# EAGLE design termocouple (EAGLE 6.5.0)
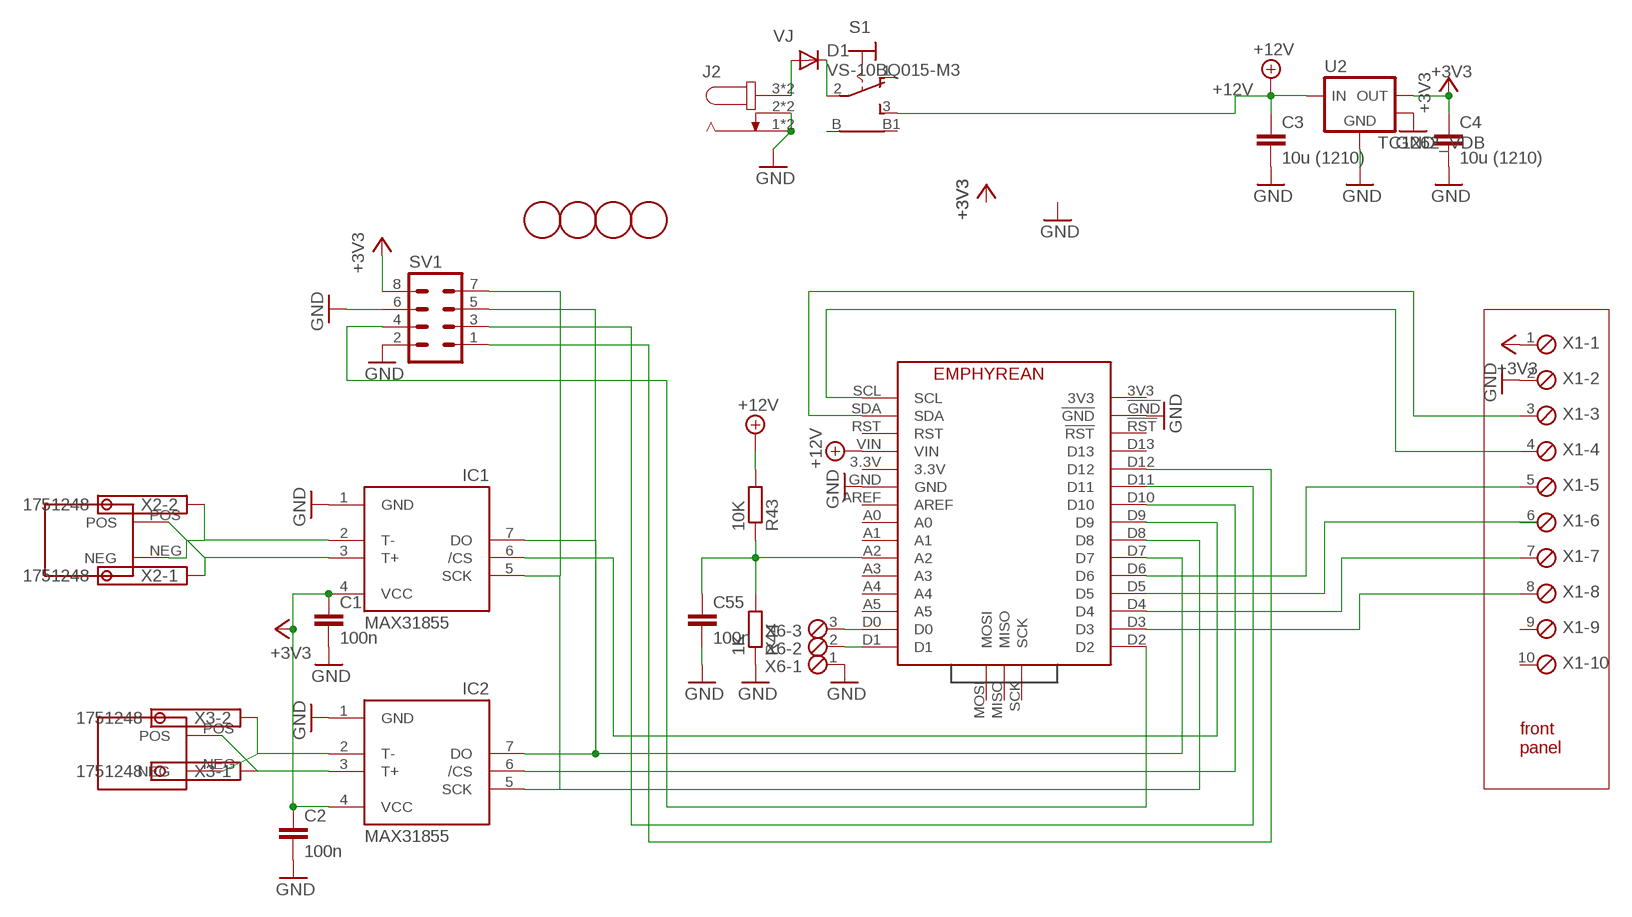
[diagram p0: schematic, sheet 1]

## Parts
C1  100n  C-EUC1206  [C1206]
C2  100n  C-EUC1206  [C1206]
C3  10u (1210)  C-EUC1210  [C1210]
C4  10u (1210)  C-EUC1210  [C1210]
C55  100n  C-EUC1206  [C1206]
D1  VS-10BQ015-M3  DIODE-SMB  [SMB]
IC1  MAX31855  MAX6675  [SO08]
IC2  MAX31855  MAX6675  [SO08]
J2  JACK-PLUG  [SPC4078]
R43  10K  R-EU_R1206  [R1206]
R44  1K  R-EU_R1206  [R1206]
S1  LPV-1  [LPV-1]
SV1  MA04-2  [MA04-2]
U2  TC1262_VDB  [SOT-223-3]
U$1  EPHYREAN  [EMPHYREAN]
U$2  THERMOCOUPLE  [THERMOCOUPLE]
U$3  THERMOCOUPLE  [THERMOCOUPLE]
U$4  FIDUCIAL  [FIDUCIAL_1MM]
U$5  FIDUCIAL  [FIDUCIAL_1MM]
U$6  FIDUCIAL  [FIDUCIAL_1MM]
U$7  FIDUCIAL  [FIDUCIAL_1MM]
X1  MPT10  [10POL254]
X2  1751248  [1751248]
X3  1751248  [1751248]
X6  MPT3  [3POL254]

## Nets
+3V3: C1.1 C2.1 C4.1 IC1.4(VCC) IC2.4(VCC) SV1.8 U2.3(VOUT) X1.1
+12V: C3.1 R43.2 S1.3(S) U2.1(VIN) U$1.VIN
GND: C1.2 C2.2 C3.2 C4.2 C55.2 IC1.1(GND) IC2.1(GND) J2.1 J2.2 J2.4 J2.5 R44.1 SV1.2 SV1.6 U2.2(GND) U2.4(TAB) U$1.!GND U$1.GND X1.2 X6.1
N$1: IC1.7(DO) IC2.7(DO) SV1.5 U$1.D7
N$2: IC1.5(SCK) IC2.5(SCK) SV1.7 U$1.D8
N$3: IC2.6(/CS) U$1.D10
N$4: IC1.6(/CS) U$1.D9
N$5: U$1.SDA X1.3
N$7: SV1.3 U$1.D11
N$8: U$1.SCL X1.4
N$9: U$1.D6 X1.5
N$10: U$1.D5
N$11: U$1.D4 X1.7
N$12: U$1.D3 X1.8
N$13: D1.C S1.2(P)
N$14: SV1.1 U$1.D12
N$15: SV1.4 U$1.D2
N$18: IC2.3(T+) U$2.POS X3.1
N$19: IC2.2(T-) U$2.NEG X3.2
N$20: IC1.3(T+) U$3.POS X2.1
N$21: IC1.2(T-) U$3.NEG X2.2
N$22: U$1.D0 X6.3
N$23: U$1.D1 X6.2
N$64: C55.1 R43.1 R44.2 U$1.A2
VJ: D1.A J2.3 J2.6
Unconnected: S1.1(O) S1.B S1.B1 U$1.3.3V U$1.3V3 U$1.!RST U$1.A0 U$1.A1 U$1.A3 U$1.A4 U$1.A5 U$1.AREF U$1.D13 U$1.MISO U$1.MOSI U$1.RST U$1.SCK X1.6 X1.9 X1.10

## Notes on the sheet
- front
  panel

## Library data of the parts
C1-C4 C55 = rcl:C-EU: CAPACITOR, European symbol
D1 = diode:DIODE-: DIODE
IC1 IC2 = adafruit:MAX6675
J2 = PI Teensy:JACK-PLUG: DC POWER JACK Power Jack, DC, Right Angle, Through Hole, Rated 5A at 16VDC, PC Terminals Distributor: Farnell (www.Farnell.de) Drawing: 84N1161.pdf / 84N1162.pdf Manufacturer: SPC Technology (www.spctechnology.com) Type: SPC4077 / SPC 4078
R43 R44 = rcl:R-EU_: RESISTOR, European symbol
S1 = switch:LPV-1: TOGGLE SWITCH
SV1 = con-lstb:MA04-2: PIN HEADER; OC_FARNELL: unknown; OC_NEWARK: unknown
U2 = bt_regulator:TC1262: Microchip TC1262 LDO Regulator The TC1262 is a fixed output, high accuracy (typically ±0.5%) CMOS low dropout regulator. Designed specif- ically for battery-operated systems, the TC1262’s CMOS construction eliminates wasted ground current, significantly extending battery life. Total supply current is typically 80A at full load (20 to 60 times lower than in bipolar regulators). TC1262 key features include ultra low noise operation, very low dropout voltage (typically 350mV at full load), and fast response to step changes in load. Datasheet.pdf <http://ww1.microchip.com/downloads/en/DeviceDoc/21373C.pdf>
U$1 = mine:EPHYREAN
U$2 U$3 = mine:THERMOCOUPLE
U$4-U$7 = tracker:FIDUCIAL: For use by pick and place machines to calibrate the vision/machine, 1mm By microbuilder.eu
X1 = con-phoenix-254:MPT10: PHOENIX CONNECTOR; OC_FARNELL: unknown; OC_NEWARK: unknown
X2 X3 = con-phoenix-350:1751248: MKDS 1/ 2-3,5 Printklemme Nennstrom: 10 A Bemessungsspannung: 160 V Raster: 3,5 mm Polzahl: 2 Montageart: Löten Anschlussart: Schraubanschluss Anschlussrichtung vom Leiter zur Platine: 0° Source: http://eshop.phoenixcontact.com .. 1751248.pdf; OC_FARNELL: unknown; OC_NEWARK: unknown
X6 = con-phoenix-254:MPT3: PHOENIX CONNECTOR; OC_FARNELL: unknown; OC_NEWARK: unknown

## Net classes
1 power: width 0.406 mm

## Board
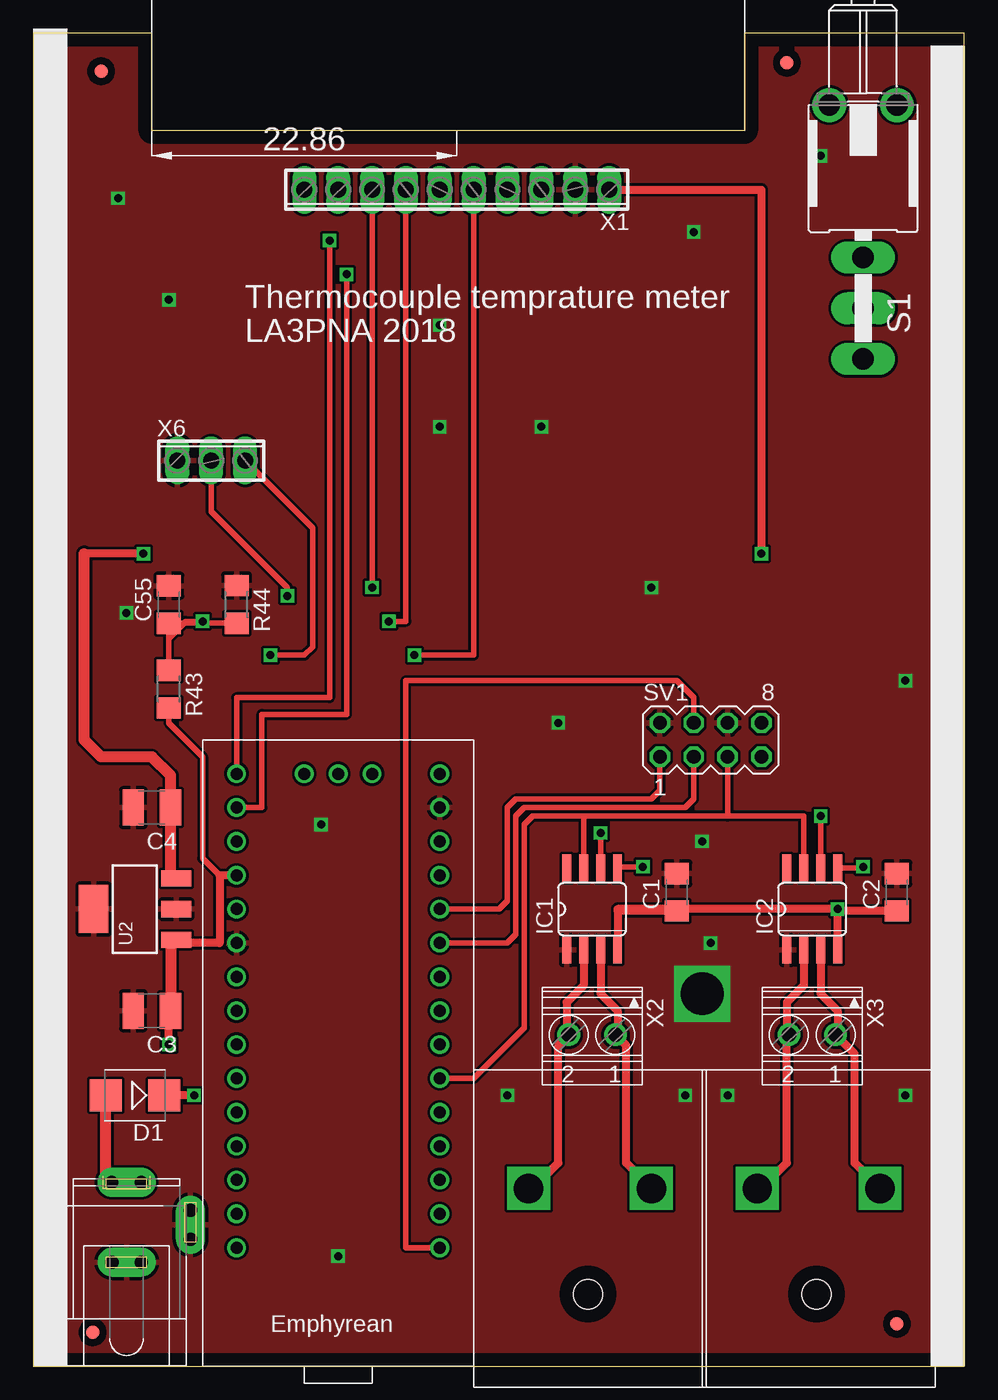
[diagram p1: board, top side]
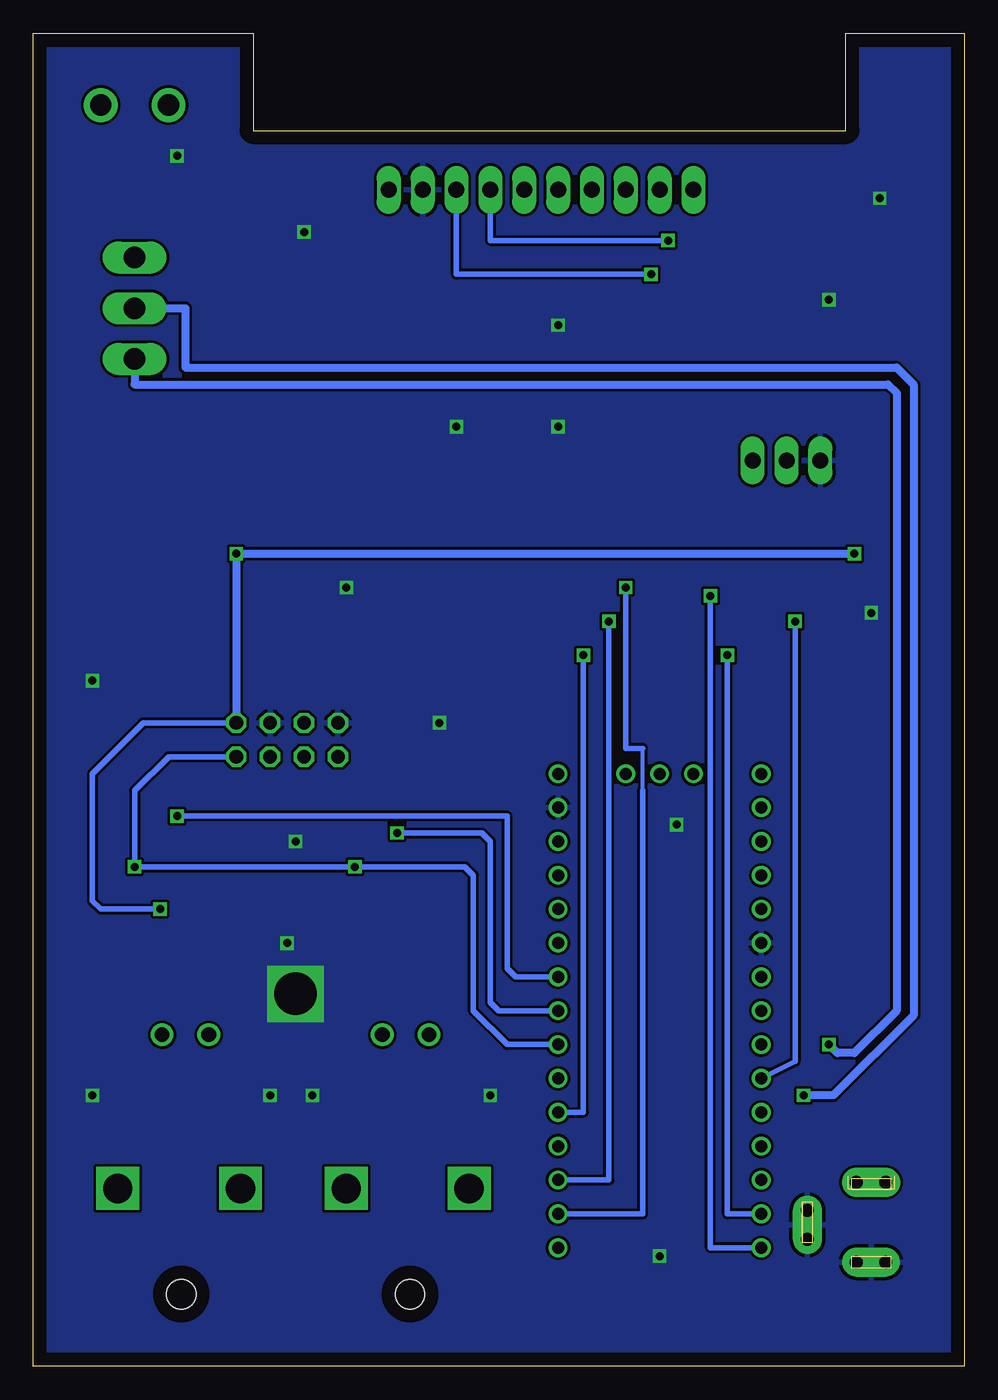
[diagram p2: board, bottom side, seen from below]

Size 69.83 x 100 mm. Coordinates in mm from the lower left corner, seen from the top.
Outline: 0,0 69.83,0 69.83,100 53.34,100 53.34,92.71 8.89,92.71 8.89,100 0,100 0,0
Copper layers (1*16): Top 0.035mm / dielectric 1.5mm / Bottom 0.035mm
Design rules "default *": minimum track width 10mil, minimum drill 24mil, track to track 8mil, track to pad 8mil, pad to pad 8mil, via to via 8mil, smd to smd 8mil, copper to edge 40mil, drill to drill 8mil, minimum pad ring 10mil, minimum via ring 8mil, stop-mask expansion 4mil, vias tented up to drill 0.7mm, thermal gap 10mil

### Footprints (pad centres in the part's own frame; a part is rotated, then mirrored left to right if it is on the bottom)
C1206 = smd 1.6 x 1.8: 1 -1.4,0; 2 1.4,0
C1210 = smd 1.6 x 2.7: 1 -1.4,0; 2 1.4,0
SMB = smd 2.4 x 2.4: A 2.2,0; C -2.2,0
SO08 = smd 0.66 x 2.032: 1 -1.905,-3.073; 2 -0.635,-3.073; 3 0.635,-3.073; 4 1.905,-3.073; 5 1.905,3.073; 6 0.635,3.073; 7 -0.635,3.073; 8 -1.905,3.073
SPC4078 = drill 0.98 pad 2.184 offset: 1 -3,-1.111; 2 -1.27,-4.8; 3 3,-1.111; 4 -2.986,1.086; 5 0.897,-4.801; 6 2.983,1.092
R1206 = smd 1.6 x 1.803: 1 -1.422,0; 2 1.422,0
LPV-1 = drill 1.6 long: 1 0,11.43; 2 0,15.24; 3 0,19.05 | drill 1.6 pad 2.54: B -2.54,0; B1 2.54,0
MA04-2 = drill 1.016 octagon: 1 -3.81,-1.27; 2 -3.81,1.27; 3 -1.27,-1.27; 4 -1.27,1.27; 5 1.27,-1.27; 6 1.27,1.27; 7 3.81,-1.27; 8 3.81,1.27
SOT-223-3 = smd 1.219 x 2.235: 1 -2.311,-3.099; 2 0,-3.099; 3 2.311,-3.099 | smd 3.6 x 2.2: 4 0,3.099
EMPHYREAN = drill 0.9: 3.3V -7.62,7.62; 3V3 7.62,17.78; !GND 7.62,15.24; !RST 7.62,12.7; A0 -7.62,0; A1 -7.62,-2.54; A2 -7.62,-5.08; A3 -7.62,-7.62; A4 -7.62,-10.16; A5 -7.62,-12.7; AREF -7.62,2.54; D0 -7.62,-15.24; D1 -7.62,-17.78; D2 7.62,-17.78; D3 7.62,-15.24; D4 7.62,-12.7; D5 7.62,-10.16; D6 7.62,-7.62; D7 7.62,-5.08; D8 7.62,-2.54; D9 7.62,0; D10 7.62,2.54; D11 7.62,5.08; D12 7.62,7.62; D13 7.62,10.16; GND -7.62,5.08; MISO 0,17.78; MOSI -2.54,17.78; RST -7.62,12.7; SCK 2.54,17.78; SCL -7.62,17.78; SDA -7.62,15.24; VIN -7.62,10.16
THERMOCOUPLE = drill 2.2 square: NEG -3.493,2.54; POS 5.715,2.54 | hole 2.2: 0.953,-5.397
FIDUCIAL_1MM = smd 1 x 1: 1 0,0
10POL254 = drill 1.2 long: 1 -11.43,0; 2 -8.89,0; 3 -6.35,0; 4 -3.81,0; 5 -1.27,0; 6 1.27,0; 7 3.81,0; 8 6.35,0; 9 8.89,0; 10 11.43,0
1751248 = drill 1.1 pad 1.7: 1 -1.75,-0.1; 2 1.75,-0.1
3POL254 = drill 1.2 long: 1 -2.54,0; 2 0,0; 3 2.54,0

### Placement (x,y rotation side)
C1  48.26,35.56 90 top
C2  64.77,35.56 90 top
C3  8.89,26.67 180 top
C4  8.89,41.91 180 top
C55  10.16,57.15 90 top
D1  7.62,20.32 180 top
IC1  41.91,34.29 0 top
IC2  58.42,34.29 0 top
J2  6.99,10.79 90 top
R43  10.16,50.8 270 top
R44  15.24,57.15 270 top
S1  62.23,94.61 180 top
SV1  50.8,46.99 0 top
U2  7.62,34.29 90 top
U$1  22.86,26.67 0 top
U$2  57.78,10.79 0 top
U$3  40.64,10.79 0 top
U$4  5.08,97.16 0 top
U$5  64.77,3.17 0 top
U$6  56.52,97.79 0 top
U$7  4.45,2.54 0 top
X1  31.75,88.27 180 top
X2  41.91,24.77 180 top
X3  58.42,24.77 180 top
X6  13.34,67.94 0 top

### Tracks (layer width: path | path; a pad name or v marks a point on that pad's centre or on a via)
+3V3  (via drill 0.6)
  Top 0.61: IC2.4 v60.33,34.29 | v60.33,34.29 43.81,34.29 43.81,34.16 | 43.81,34.16 IC1.4 | v8.26,60.96 3.81,60.96 | X1.1 54.61,88.27 v54.61,60.96 | C2.1 60.33,34.16 v60.33,34.29 | C1.1 43.81,34.16
  Top 0.813: U2.3 10.29,36.6 C4.1 10.29,44.32 8.89,45.72 5.08,45.72 3.81,46.99 3.81,60.96
  Bottom 0.406: SV1.8 61.59,48.26 65.41,44.45 65.41,34.92 64.77,34.29 v60.33,34.29
  Bottom 0.61: v8.26,60.96 v54.61,60.96 SV1.8
+12V  (via drill 0.6)
  Top 0.406: R43.2 10.16,48.26 12.7,45.72 12.7,38.1 13.97,36.83
  Top 0.61: U$1.VIN 13.97,36.83 13.97,31.75 10.72,31.75 U2.1 | v10.16,24.13 10.16,27.18 10.29,27.3
  Top 0.813: U2.1 10.29,31.98 10.29,27.3 C3.1
  Bottom 0.61: S1.3 62.23,73.66 5.71,73.66 5.08,73.03 5.08,26.67 8.26,23.5 9.53,23.5 v10.16,24.13
GND  (via drill 0.6, 3.2)
  other vias: 6.35,87.63 10.16,80.01 49.53,85.09 35.56,20.32 48.9,20.32 65.41,20.32 50.16,39.37 50.8,31.75 50.16,27.94 52.07,20.32 22.86,8.26 46.35,58.42 30.48,78.11 38.1,70.48 30.48,70.48 59.05,90.81 65.41,51.44 39.37,48.26 39.37,48.26 21.59,40.64 6.99,56.52
  pour Bottom: -2.54,-2.54 74.93,-2.54 74.93,104.14 -2.54,104.14
  pour Top: -6.35,-3.81 73.66,-3.81 73.66,101.6 -6.35,101.6
N$1
  Top 0.406: IC2.7 57.78,41.27 52.07,41.27 | 52.07,41.27 41.27,41.27 | 41.27,41.27 IC1.7 | U$1.D7 33.02,21.59 36.83,25.4 36.83,40.64 37.47,41.27 41.27,41.27 | SV1.5 52.07,41.27
N$2  (via drill 0.6)
  Top 0.406: v45.72,37.47 43.92,37.47 IC1.5 | IC2.5 62.13,37.36 v62.23,37.47
  Bottom 0.406: U$1.D8 34.29,24.13 36.83,26.67 36.83,36.83 37.47,37.47 v45.72,37.47 v62.23,37.47 62.23,43.18 59.69,45.72 SV1.7
N$3  (via drill 0.6)
  Top 0.406: v59.05,41.27 IC2.6
  Bottom 0.406: U$1.D10 33.66,29.21 34.29,29.84 34.29,41.27 v59.05,41.27
N$4  (via drill 0.6)
  Top 0.406: IC1.6 v42.55,40.01
  Bottom 0.406: v42.55,40.01 36.2,40.01 35.56,39.37 35.56,27.3 34.92,26.67 U$1.D9
N$5  (via drill 0.6)
  Top 0.406: U$1.SDA 17.14,41.91 17.14,48.9 23.5,48.9 v23.5,81.92
  Bottom 0.406: v23.5,81.92 38.1,81.92 X1.3
N$7
  Top 0.406: U$1.D11 35.56,31.75 36.2,32.38 36.2,41.27 36.83,41.91 48.9,41.91 49.53,42.55 SV1.3
N$8  (via drill 0.6)
  Top 0.406: v22.23,84.45 22.23,50.16 15.24,50.16 U$1.SCL
  Bottom 0.406: X1.4 35.56,84.45 v22.23,84.45
N$9  (via drill 0.6)
  Top 0.406: v28.57,53.34 33.02,53.34 X1.5
  Bottom 0.406: U$1.D6 28.57,19.05 v28.57,53.34
N$11  (via drill 0.6)
  Top 0.406: v26.67,55.88 27.94,55.88 X1.7
  Bottom 0.406: U$1.D4 26.67,13.97 v26.67,55.88
N$12  (via drill 0.6)
  Top 0.406: v25.4,58.42 X1.8
  Bottom 0.305: 24.13,43.18 24.13,46.35
  Bottom 0.406: U$1.D3 24.13,11.43 24.13,43.18 | 24.13,46.35 25.4,46.35 v25.4,58.42
N$13  (via drill 0.6)
  Top 0.61: v12.06,20.32 D1.C
  Bottom 0.61: S1.2 58.42,79.38 58.42,74.93 5.08,74.93 3.81,73.66 3.81,26.33 D1.C v12.06,20.32
N$14
  Top 0.406: SV1.1 46.99,43.18 46.35,42.55 36.2,42.55 35.56,41.91 35.56,34.92 34.92,34.29 U$1.D12
N$15
  Top 0.406: U$1.D2 27.94,8.89 27.94,51.44 48.26,51.44 49.53,50.16 SV1.4
N$18
  Top 0.61: U$2.POS 61.59,15.24 61.59,23.44 X3.1 60.33,25.02 60.33,26.67 59.05,27.94 IC2.3
N$19
  Top 0.61: U$2.NEG 54.61,13.34 56.52,15.24 56.52,24.71 X3.2 56.52,25.02 56.52,27.3 57.78,28.57 IC2.2
N$20
  Top 0.61: IC1.3 42.55,27.94 43.81,26.67 43.81,25.02 X2.1 44.45,24.07 44.45,15.24 U$3.POS
N$21
  Top 0.61: U$3.NEG 37.47,13.34 39.37,15.24 39.37,24.07 X2.2 40.01,25.02 40.01,27.3 41.27,28.57 IC1.2
N$22  (via drill 0.6)
  Top 0.406: v17.78,53.34 20.32,53.34 20.95,53.98 20.95,62.87 X6.3
  Bottom 0.406: U$1.D0 17.78,11.43 v17.78,53.34
N$23  (via drill 0.6)
  Top 0.406: v19.05,57.78 19.05,58.42 13.34,64.14 X6.2
  Bottom 0.406: U$1.D1 19.05,8.89 v19.05,57.78
N$64  (via drill 0.6)
  Top 0.406: R44.2 15.22,55.75 C55.1 R43.1 10.16,54.61 11.43,55.88 v12.7,55.88
  Bottom 0.406: v12.7,55.88 12.7,22.86 U$1.A2
VJ
  Top 0.254: J2.3 7.62,13.97 6.35,13.97 J2.6
  Top 0.813: J2.6 5.42,14.41 D1.A

### Text on the board
tNames: Thermocouple temprature meter | LA3PNA 2018